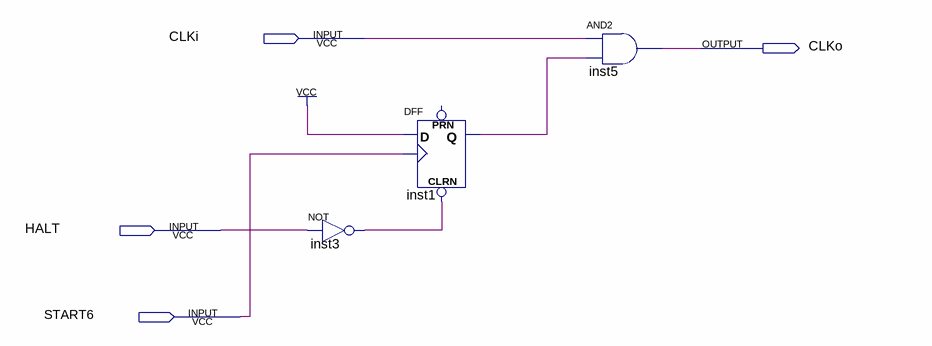
[diagram p0: schematic sheet]
// Quartus schematic ks_simp.bdf as structural Verilog: 3 symbols, 4 pins
module ks_simp (
  input  CLKi,
  input  HALT,
  input  START6,
  output CLKo
);

  wire inst1_q, inst3_out;

  not inst3 (inst3_out, HALT);
  DFF inst1 (.CLRN(inst3_out), .CLK(START6), .D(1'b1), .Q(inst1_q));  // open: PRN
  and inst5 (CLKo, CLKi, inst1_q);
endmodule
